# EAGLE schematic four-step-octaved_1.1 (EAGLE 8.2.2)
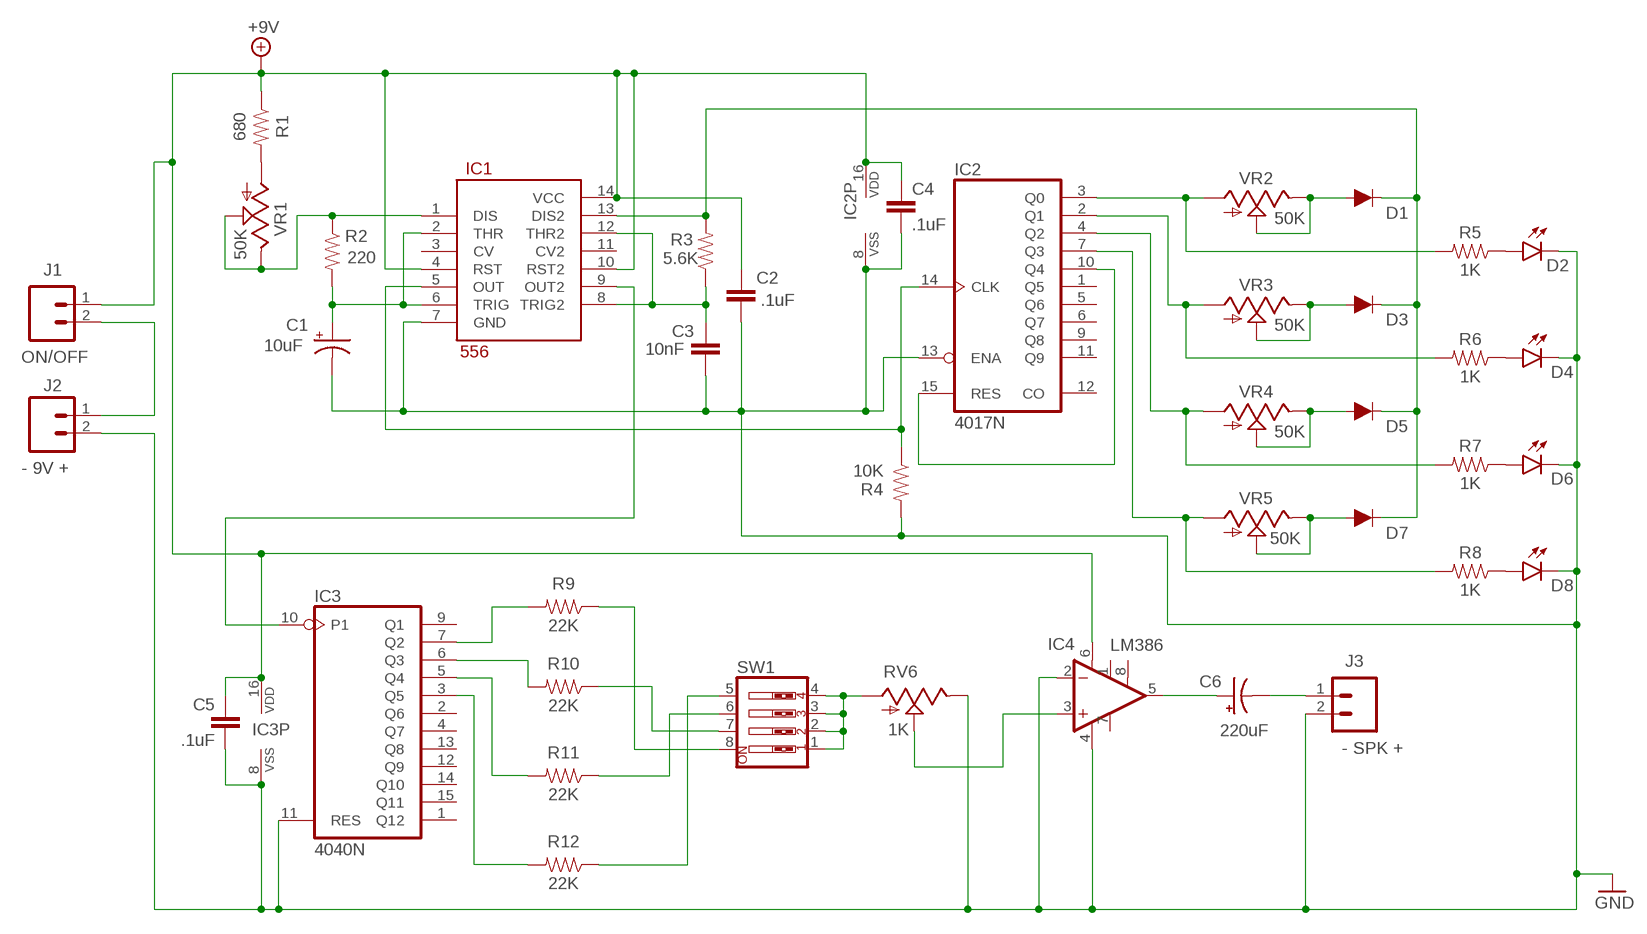
[diagram p0: schematic, sheet 1]

## Parts
C1  10uF  10UF-POLAR-RADIAL-2.5MM-25V-20%  [CPOL-RADIAL-2.5MM-5MM]
C2  .1uF  0.1UF-KIT-EZ-50V-20%  [CAP-PTH-SMALL-KIT]
C3  10nF  0.1UF-KIT-EZ-50V-20%  [CAP-PTH-SMALL-KIT]
C4  .1uF  0.1UF-KIT-EZ-50V-20%  [CAP-PTH-SMALL-KIT]
C5  .1uF  0.1UF-KIT-EZ-50V-20%  [CAP-PTH-SMALL-KIT]
C6  220uF  10UF-POLAR-RADIAL-2.5MM-25V-20%  [CPOL-RADIAL-2.5MM-5MM]
D1  DIODE-PTH  [DIODE-1N4001]
D2  LED3MM  [LED_3MM]
D3  DIODE-PTH  [DIODE-1N4001]
D4  LED3MM  [LED_3MM]
D5  DIODE-PTH  [DIODE-1N4001]
D6  LED3MM  [LED_3MM]
D7  DIODE-PTH  [DIODE-1N4001]
D8  LED3MM  [LED_3MM]
IC1  556  [DIP14]
IC2  4017N  [DIL16]
IC3  4040N  [DIL16]
IC4  LM386  [DIP08]
J1  ON/OFF  CONN_02  [1X02]
J2  - 9V +  CONN_02  [1X02]
J3  - SPK +  CONN_02  [1X02]
R1  680  1KOHM-HORIZ-1/4W-1%  [AXIAL-0.3]
R2  220  1KOHM-HORIZ-1/4W-1%  [AXIAL-0.3]
R3  5.6K  1KOHM-HORIZ-1/4W-1%  [AXIAL-0.3]
R4  10K  1KOHM-HORIZ-1/4W-1%  [AXIAL-0.3]
R5  1K  1KOHM-HORIZ-1/4W-1%  [AXIAL-0.3]
R6  1K  1KOHM-HORIZ-1/4W-1%  [AXIAL-0.3]
R7  1K  1KOHM-HORIZ-1/4W-1%  [AXIAL-0.3]
R8  1K  1KOHM-HORIZ-1/4W-1%  [AXIAL-0.3]
R9  22K  1KOHM-HORIZ-1/4W-1%  [AXIAL-0.3]
R10  22K  1KOHM-HORIZ-1/4W-1%  [AXIAL-0.3]
R11  22K  1KOHM-HORIZ-1/4W-1%  [AXIAL-0.3]
R12  22K  1KOHM-HORIZ-1/4W-1%  [AXIAL-0.3]
RV6  1K  POTTRIM  [TRIM_POT]
SW1  SW_DIP-4  [EDG-04]
VR1  50K  POTTRIM  [TRIM_POT]
VR2  50K  POTTRIM  [TRIM_POT]
VR3  50K  POTTRIM  [TRIM_POT]
VR4  50K  POTTRIM  [TRIM_POT]
VR5  50K  POTTRIM  [TRIM_POT]

## Nets
+9V [supply]: C2.1 C4.1 C5.1 IC1.4(RST) IC1.10(RST2) IC1.14(VCC) IC2.16(VDD) IC3.16(VDD) IC4.6(V+) J1.1 R1.P$1
GND [supply]: C1.2(-) C2.2 C3.2 C4.2 C5.2 D2.K(C) D4.K(C) D6.K(C) D8.K(C) IC1.7(GND) IC2.8(VSS) IC2.13(ENA) IC3.8(VSS) IC3.11(RES) IC4.2(-IN) IC4.4(V-) J2.2 J3.2 R4.P$2 RV6.2(E)
N$1 [new default]: R1.P$2 VR1.3(A)
N$2 [new default]: IC1.1(DIS) R2.P$1 VR1.1(S) VR1.2(E)
N$3 [new default]: C1.1(+) IC1.2(THR) IC1.6(TRIG) R2.P$2
N$4 [new default]: IC2.10(Q4) IC2.15(RES)
N$5 [new default]: IC1.5(OUT) IC2.14(CLK) R4.P$1
N$6 [new default]: C3.1 IC1.8(TRIG2) IC1.12(THR2) R3.P$1
N$7 [new default]: IC2.3(Q0) R5.P$2 VR2.3(A)
N$8 [new default]: IC2.2(Q1) R6.P$2 VR3.3(A)
N$9 [new default]: IC2.4(Q2) R7.P$2 VR4.3(A)
N$10 [new default]: IC2.7(Q3) R8.P$2 VR5.3(A)
N$11 [new default]: D1.A VR2.1(S) VR2.2(E)
N$12 [new default]: D8.A R8.P$1
N$13 [new default]: D6.A R7.P$1
N$14 [new default]: D4.A R6.P$1
N$15 [new default]: D2.A R5.P$1
N$16 [new default]: D3.A VR3.1(S) VR3.2(E)
N$17 [new default]: D5.A VR4.1(S) VR4.2(E)
N$18 [new default]: D7.A VR5.1(S) VR5.2(E)
N$19 [new default]: D1.C D3.C D5.C D7.C IC1.13(DIS2) R3.P$2
N$20 [new default]: IC3.7(Q2) R9.P$2
N$21: IC3.5(Q4) R11.P$2
N$22 [new default]: IC3.6(Q3) R10.P$2
N$23: R12.P$1 SW1.5
N$24 [new default]: IC4.3(+IN) RV6.1(S)
N$25: IC3.3(Q5) R12.P$2
N$26: R11.P$1 SW1.6
N$27 [new default]: C6.2(-) J3.1
N$28 [new default]: C6.1(+) IC4.5(OUT)
N$29: R10.P$1 SW1.7
N$30: R9.P$1 SW1.8
N$31: RV6.3(A) SW1.1 SW1.2 SW1.3 SW1.4
N$32: J1.2 J2.1
N$43 [new default]: IC1.9(OUT2) IC3.10(P1)
Unconnected: IC1.3(CV) IC1.11(CV2) IC2.1(Q5) IC2.5(Q6) IC2.6(Q7) IC2.9(Q8) IC2.11(Q9) IC2.12(CO) IC3.1(Q12) IC3.2(Q6) IC3.4(Q7) IC3.9(Q1) IC3.12(Q9) IC3.13(Q8) IC3.14(Q10) IC3.15(Q11) IC4.1(GAIN) IC4.7(BP) IC4.8(GAIN)

## Library data of the parts
C1 = SparkFun-Capacitors:10UF-POLAR: 10.0µF polarized capacitors A capacitor is a passive two-terminal electrical component used to store electrical energy temporarily in an electric field.; PROD_ID: CAP-08440
C2-C5 = SparkFun-Capacitors:0.1UF: 0.1µF ceramic capacitors A capacitor is a passive two-terminal electrical component used to store electrical energy temporarily in an electric field.; PROD_ID: CAP-08370; VALUE: 0.1uF
C6 = SparkFun-Capacitors:10UF-POLAR: 10.0µF polarized capacitors A capacitor is a passive two-terminal electrical component used to store electrical energy temporarily in an electric field.; PROD_ID: CAP-08440; VALUE: 10uF
D1 D3 D5 D7 = SparkFun-DiscreteSemi:DIODE: Diode These are standard reverse protection diodes and small signal diodes. SparkFun Products: SparkFun SparkPunk Sound Kit <https://www.sparkfun.com/products/11177> SparkFun ESP8266 Thing <https://www.sparkfun.com/products/13231>; PROD_ID: DIO-09176; VALUE: 1A/50V/1.1V
D2 D4 D6 D8 = SparkFun-LED:LED: LED (Generic) Standard schematic elements and footprints for 5mm, 3mm, 1206, and 0603 sized LEDs. Generic LEDs with no color specified.; PROD_ID: DIO-08794
IC1 = SparkFun-IC-Special-Function:556: 556 Dual 555 timer 2 555 timers in one package 1MHZ 14DIP Datasheet <https://cdn.sparkfun.com/datasheets/Kits/icm7555-56.pdf> SparkFun Products SparkFun SparkPunk Sound Kit <https://www.sparkfun.com/products/11177> (KIT-11177); PROD_ID: IC-11898
IC2 = 40xx:4017: COUNTER/DIVIDER
IC3 = 40xx:4040: 12-stage binary/ripple COUNTER
IC4 = SparkFun-IC-Amplifiers:LM386: low voltage audio power amplifier SparkFun Products FabFM Radio Kit <https://www.sparkfun.com/products/11043> (KIT-11043); PROD_ID: IC-10899; VALUE: LM386N
J1-J3 = SparkFun-Connectors:CONN_02: Multi connection point. Often used as Generic Header-pin footprint for 0.1 inch spaced/style header connections On any of the 0.1 inch spaced packages, you can populate with these: Break Away Headers - Straight <https://www.sparkfun.com/products/116> (PRT-00116) Break Away Male Headers - Right Angle <https://www.sparkfun.com/products/553> (PRT-00553) Female Headers <https://www.sparkfun.com/products/115> (PRT-00115) Break Away Headers - Machine Pin <https://www.sparkfun.com/products/117> (PRT-00117) Break Away Female Headers - Swiss Machine Pin <https://www.sparkfun.com/products/743> (PRT-00743) For SCREWTERMINALS and SPRING TERMINALS visit here: Screw Terimnals on SparkFun.com <https://www.sparkfun.com/search/results?term=Screw+Terminals> (5mm/3.5mm/2.54mm spacing) This device is also useful as a general connection point to wire up your design to another part of your project. Our various solder wires solder well into these plated through hole pads. Hook-Up Wire - Assortment (Stranded, 22 AWG) <https://www.sparkfun.com/products/11375> (PRT-11375) Hook-Up Wire - Assortment (Solid Core, 22 AWG) <https://www.sparkfun.com/products/11367> (PRT-11367) View the entire wire category on our website here <https://www.sparkfun.com/categories/141> Special notes: Molex polarized connector foot print use with: PRT-08233 with associated crimp pins and housings. 2.54_SCREWTERM for use with PRT-10571. 3.5mm Screw Terminal footprints for PRT-08084 5mm Screw Terminal footprints for use with PRT-08432
R1-R12 = SparkFun-Resistors:1KOHM: 1kΩ resistor A resistor is a passive two-terminal electrical component that implements electrical resistance as a circuit element. Resistors act to reduce current flow, and, at the same time, act to lower voltage levels within circuits. - Wikipedia; PROD_ID: RES-12182; VALUE: 1k
RV6 VR1-VR5 = SparkFun-Retired:POT; PROD_ID: COM-00104
SW1 = special:SW_DIP-4: DIP SWITCH

## Net classes
1 new default: width 0.254 mm, clearance 0.254 mm
2 supply: width 0.508 mm, clearance 0.508 mm